# EAGLE design breakout_da14580 (EAGLE 7.2.0)
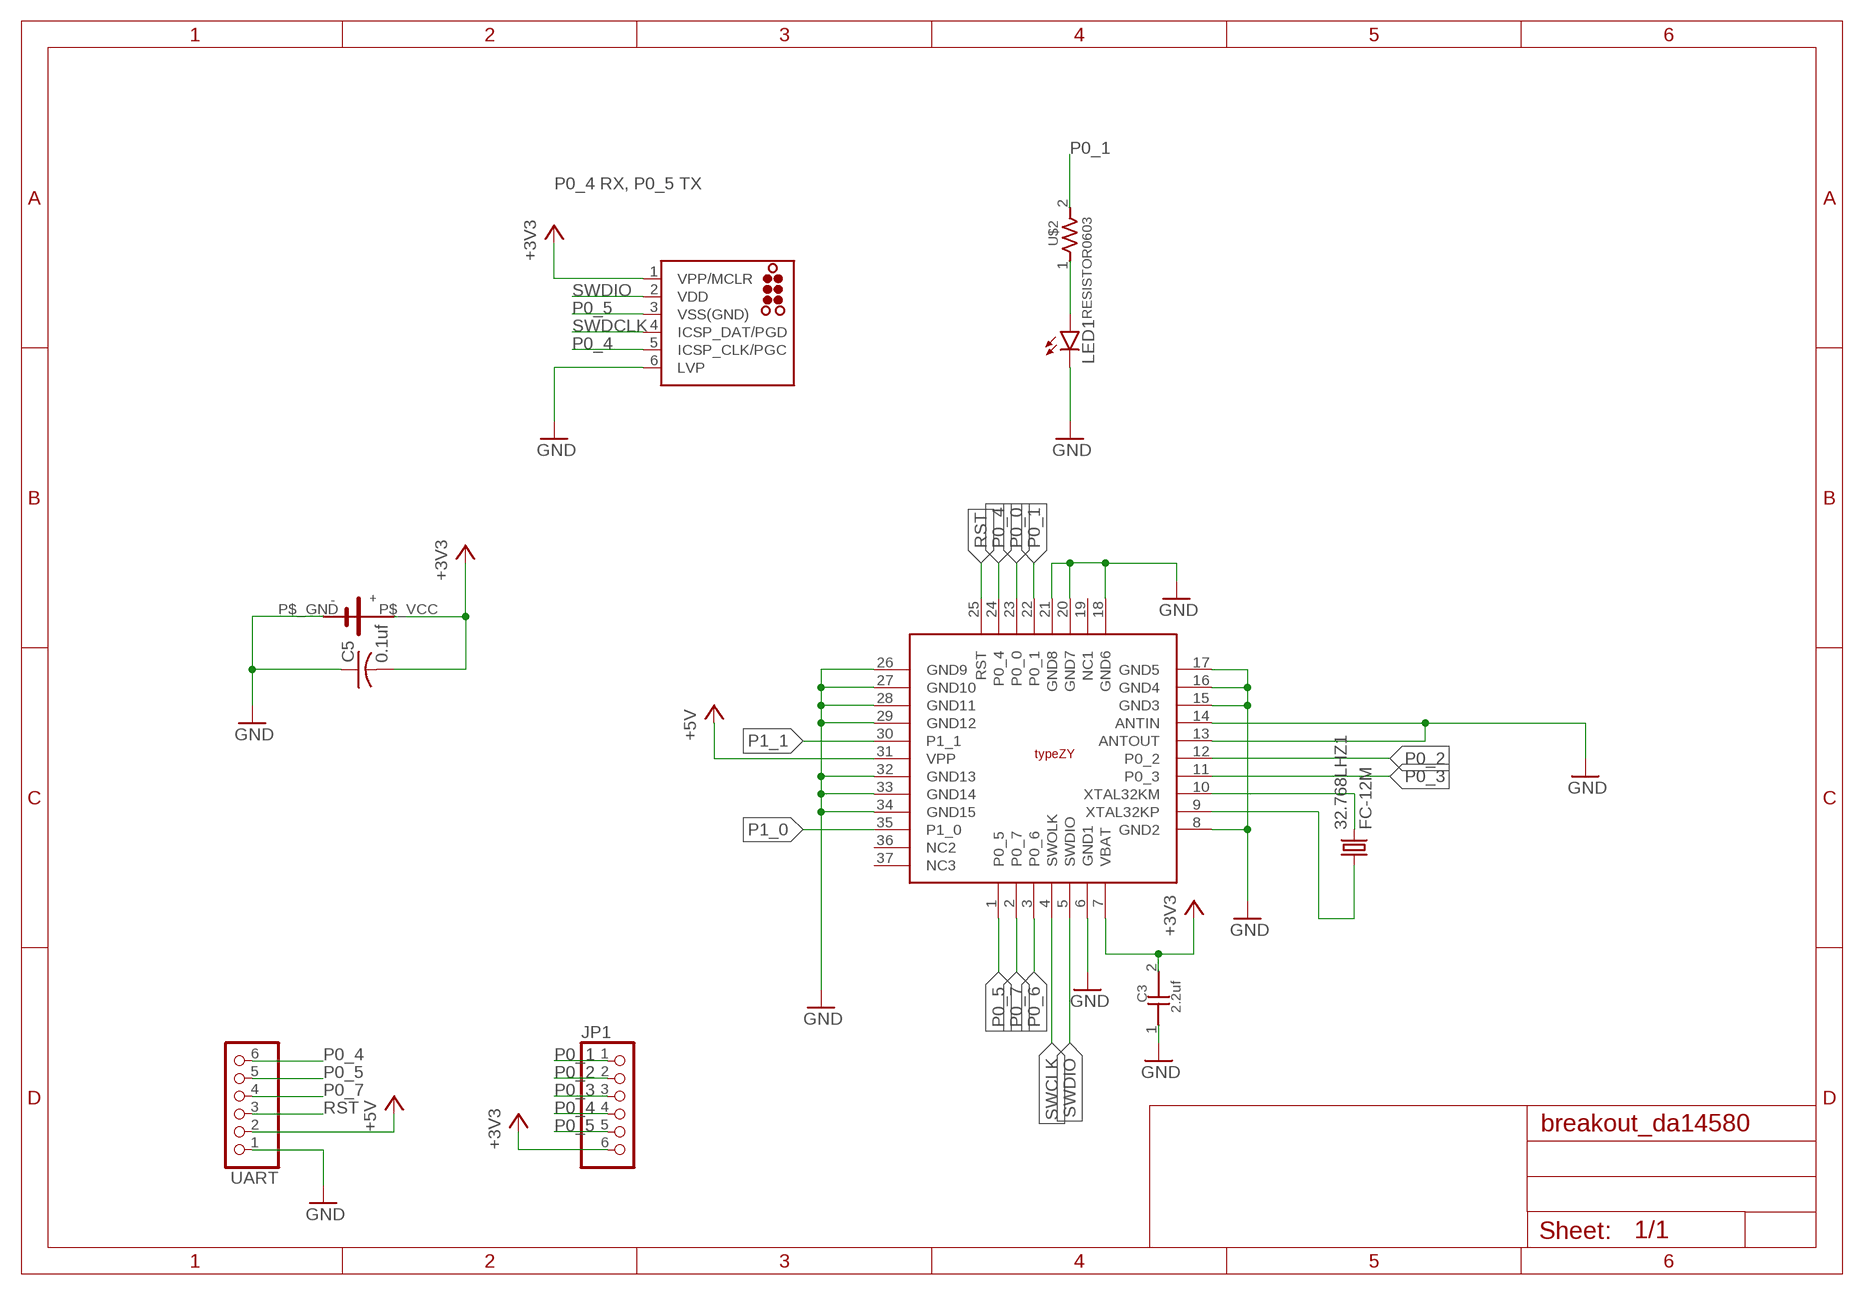
[diagram p0: schematic, sheet 1]

## Parts
32.768LHZ1  FC-12M  [FC-12M]
C3  2.2uf  CAPACITOR0603  [0603]
C5  0.1uf  C-USC0603  [C0603]
J1  TC2030-MCP  [TC2030-MCP]
JP1  PINHD-1X6  [1X06]
LED1  LED-EIA0603  [EIA0603-LED]
U$1  MURATA-TYPEZY  [MURATA_TYPEZY]
U$2  RESISTOR0603  [0603]
U$3  SMTU2450-BOTTOM-MINI  [SMTU2450-BOTTOM-MINI]
UART  PINHD-1X6  [1X06]

## Nets
+3V3: C3.2 C5.2 J1.1(VPP/MCLR) JP1.6 U$1.7(VBAT) U$3.P$_VCC
+5V: U$1.31(VPP) UART.2
GND: C3.1 C5.1 J1.6(LVP) LED1.C U$1.6(GND1) U$1.8(GND2) U$1.13(ANTOUT) U$1.14(ANTIN) U$1.15(GND3) U$1.16(GND4) U$1.17(GND5) U$1.18(GND6) U$1.20(GND7) U$1.21(GND8) U$1.26(GND9) U$1.27(GND10) U$1.28(GND11) U$1.29(GND12) U$1.32(GND13) U$1.33(GND14) U$1.34(GND15) U$3.P$_GND UART.1
N$1: LED1.A U$2.1
P0_0: U$1.23(P0_0)
P0_1: JP1.1 U$1.22(P0_1) U$2.2
P0_2: JP1.2 U$1.12(P0_2)
P0_3: JP1.3 U$1.11(P0_3)
P0_4: J1.5(ICSP_CLK/PGC) JP1.4 U$1.24(P0_4) UART.6
P0_5: J1.3(VSS(GND)) JP1.5 U$1.1(P0_5) UART.5
P0_6: U$1.3(P0_6)
P0_7: U$1.2(P0_7) UART.4
P1_0: U$1.35(P1_0)
P1_1: U$1.30(P1_1)
RST: U$1.25(RST) UART.3
SWCLK: U$1.4(SWOLK)
SWDCLK: J1.4(ICSP_DAT/PGD)
SWDIO: J1.2(VDD) U$1.5(SWDIO)
XTAL32KM: 32.768LHZ1.2 U$1.10(XTAL32KM)
XTAL32KP: 32.768LHZ1.1 U$1.9(XTAL32KP)
Unconnected: U$1.19(NC1) U$1.36(NC2) U$1.37(NC3)

## Notes on the sheet
- P0_4 RX, P0_5 TX

## Library data of the parts
32.768LHZ1 = crystal:FC-12M: kHz RANGE CRYSTAL UNIT LOW PROFILE SMD Source: Epson Toyocom FC-12M.pdf
C3 = GClue-Capacitor:CAPACITOR
C5 = adafruit:C-US: CAPACITOR, American symbol
J1 = tag-connect:TC2030: TAG-CONNECT ICSP Connector Manufacturer: Tag-Connect <http://www.tag-connect.com> Cable for easy In-Circuit Serial Programming. Designed for Microchip ICD2, suitable for many others. Two variants - one "with legs" (for hands-free fit on PCB) and another "without legs" for quick programming. PAD Description 1 MCLR/Vpp 2 Vdd 3 GND 4 PGD (ISPDAT) 5 PGC (ISPCLK) 6 nc (used for LVP) ©2009 ROFA.cz - modified and updated by Robert Darlington ‹rdarlington@gmail.com›
JP1 UART = adafruit:PINHD-1X6: PIN HEADER
LED1 = gclue:LED: LED
U$1 = GClueBT:MURATA-TYPEZY
U$2 = GClue-Resistors:RESISTOR
U$3 = gclue:SMTU2450-BOTTOM-MINI

## Board
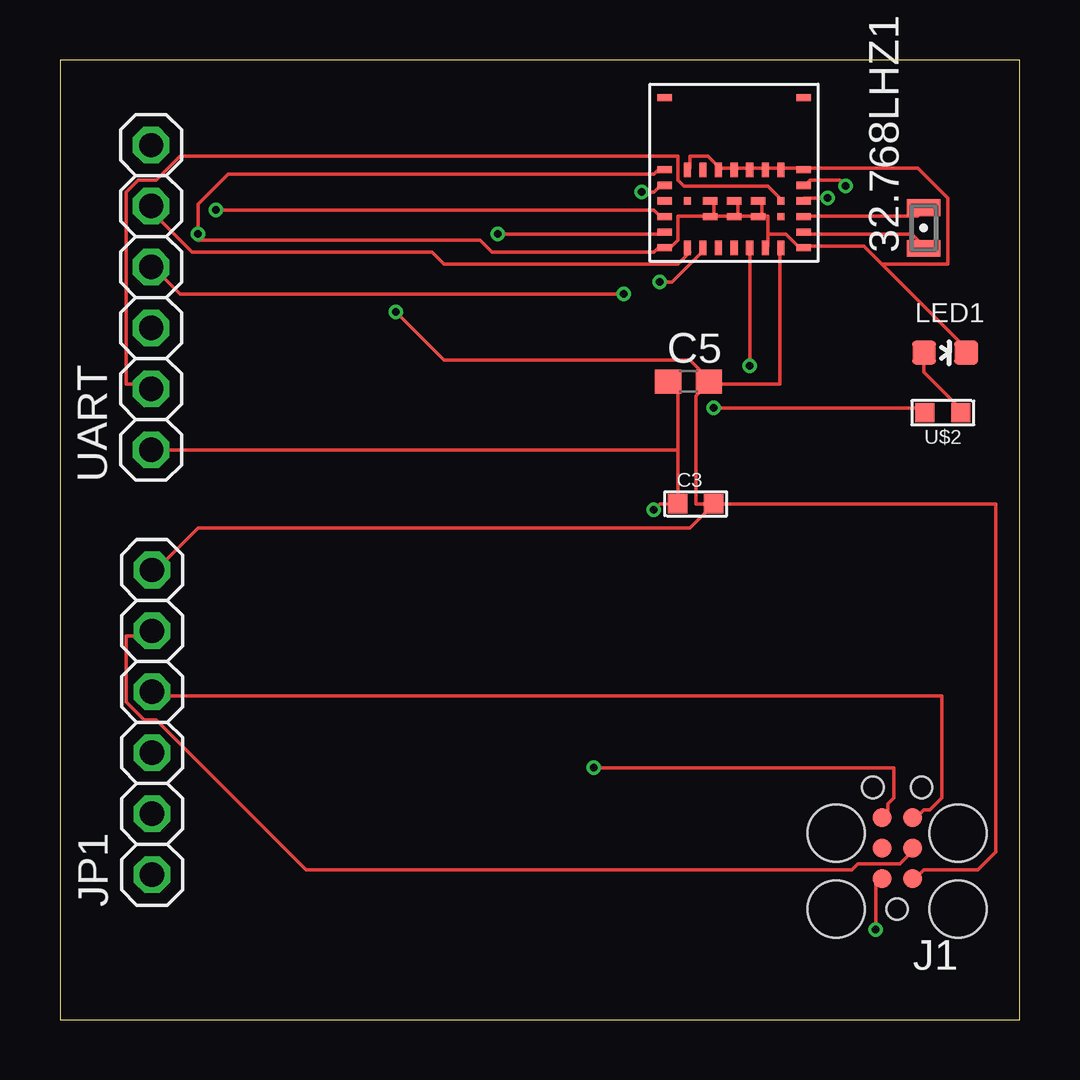
[diagram p1: board, top side]
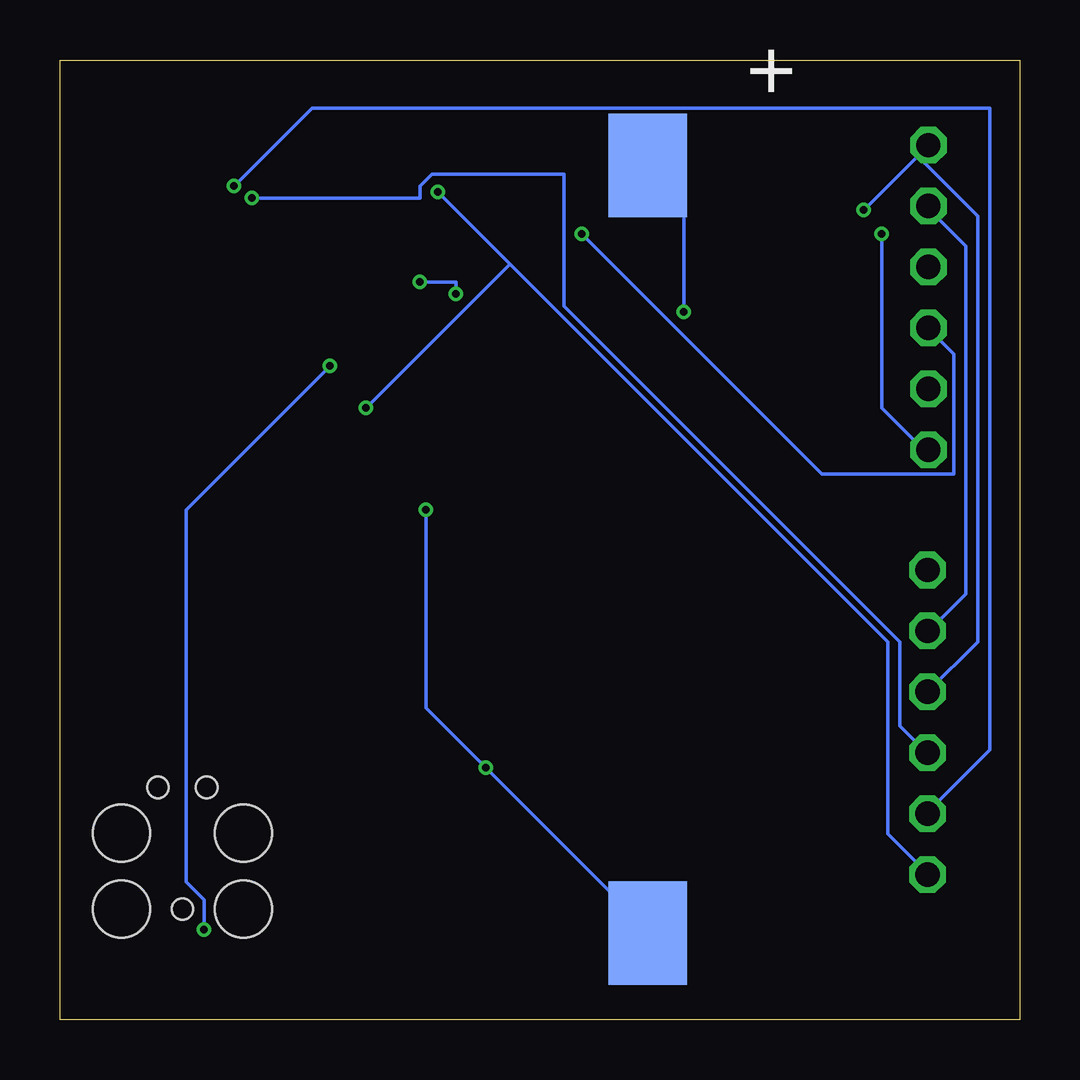
[diagram p2: board, bottom side, seen from below]

Size 40 x 40 mm. Coordinates in mm from the lower left corner, seen from the top.
Outline: 0,0 40,0 40,40 0,40 0,0
Copper layers (1*16): Top 0.035mm / dielectric 1.5mm / Bottom 0.035mm
Design rules "SeeedStudio_2layer_DRU_no_angle_20140221": minimum track width 6mil, minimum drill 12mil, track to track 6mil, track to pad 6mil, pad to pad 6mil, via to via 6mil, smd to smd 0mil, copper to edge 10mil, drill to drill 10mil, minimum pad ring 10mil, minimum via ring 6mil, stop-mask expansion 2mil, vias tented up to drill 100mil, thermal gap 10mil

### Footprints (pad centres in the part's own frame; a part is rotated, then mirrored left to right if it is on the bottom)
FC-12M = smd 0.7 x 1.4: 1 -0.85,0; 2 0.85,0
0603 = smd 0.8 x 0.8: 1 -0.75,0; 2 0.75,0
C0603 = smd 1.1 x 1: 1 -0.85,0; 2 0.85,0
TC2030-MCP = smd 0.787 x 0.787: 1 1.27,-0.635; 2 1.27,0.635; 3 2.54,-0.635; 4 2.54,0.635; 5 3.81,-0.635; 6 3.81,0.635 | hole 0.889: 0,0; 5.08,-1.016; 5.08,1.016 | hole 2.375: 0,2.54; 0,-2.54; 3.175,-2.54; 3.175,2.54
1X06 = drill 1.016 octagon: 1 -6.35,0; 2 -3.81,0; 3 -1.27,0; 4 1.27,0; 5 3.81,0; 6 6.35,0
EIA0603-LED = smd 1 x 1: A 0,-0.877; C 0,0.877
MURATA_TYPEZY = smd 0.3 x 0.6: 1 -1.95,-1.625; 2 -1.3,-1.625; 3 -0.65,-1.625; 4 0,-1.625; 5 0.65,-1.625; 6 1.3,-1.625; 7 1.95,-1.625; 14 1.95,1.625; 15 1.3,1.625; 16 0.65,1.625; 17 0,1.625; 18 -0.65,1.625; 19 -1.3,1.625; 20 -1.95,1.625 | smd 0.6 x 0.3: 8 2.9,-1.625; 9 2.9,-0.975; 10 2.9,-0.325; 11 2.9,0.325; 12 2.9,0.975; 13 2.9,1.625; 21 -2.9,1.625; 22 -2.9,0.975; 23 -2.9,0.325; 24 -2.9,-0.325; 25 -2.9,-0.975; 26 -2.9,-1.625; 27 -1,-0.325; 28 0,-0.325; 29 1,-0.325; 32 1,0.325; 33 0,0.325; 34 -1,0.325; 36 2.9,4.625; 37 -2.9,4.625 | smd 0.3 x 0.3: 30 1.95,-0.325; 31 1.95,0.325; 35 -1.95,0.325
SMTU2450-BOTTOM-MINI = smd 3.251 x 4.318 bottom: P$_GND 0,-16; P$_VCC 0,16

### Placement (x,y rotation side)
32.768LHZ1  36,33 90 top
C3  26.5,21.5 0 top
C5  26.2,26.6 0 top
J1  34.9,4.6 90 top
JP1  3.84,12.39 90 top
LED1  36.9,27.8 270 top
U$1  28.1,33.8 0 top
U$2  36.8,25.3 180 top
U$3  15.5,19.6 0 top
UART  3.8,30.1 90 top

### Tracks (layer width: path | path; a pad name or v marks a point on that pad's centre or on a via)
+3V3  (via drill 0.3)
  Top 0.152: U$1.7 30,32 30,26.5 27.25,26.5 C5.2 | C3.2 39,21.5 39,7 38.25,6.25 36,6.25 35.75,6 J1.1 | C3.2 26.25,20.5 5.75,20.5 4,18.75 JP1.6 | C3.2 26.5,21.5 26.5,26 27,26.5 C5.2 | v14,29.5 16,27.5 26.25,27.5 27,26.75 C5.2
  Bottom 0.152: v14,29.5 14,34 15.5,35.5 U$3.P$_VCC
+5V
  Top 0.152: U$1.31 30,34.25 29.5,34.75 26,34.75 25.75,35 25.75,36 5,36 4,35 3.25,35 2.75,34.5 2.75,26.5 3.75,26.5 UART.2
GND  (via drill 0.3)
  Top 0.152: v22.25,10.5 34.75,10.5 34.75,9.25 34.5,9 34.5,8.5 J1.6 | 25.75,23.75 25.75,26.5 25.5,26.5 C5.1 | 25.75,23.75 C3.1 25,21.5 v24.75,21.25 | UART.1 25.75,23.75 | 30,35.5 29.5,35.5 | 30,35.5 31,35.5 | 30,35.5 U$1.14 | 27.5,35.5 27,36 26.25,36 26.25,35.5 U$1.20 | 27.5,35.5 28,35.5 | 27.5,35.5 U$1.18 | 28,35.5 28.75,35.5 | 28,35.5 U$1.17 | 28.75,35.5 29.5,35.5 | 29.5,35.5 U$1.15 | 28.75,35.5 U$1.16 | 28.25,33.5 28.25,34 U$1.33 | 29.25,33.5 29.25,34 U$1.32 | 29.5,32.75 29.5,33.5 29.25,33.5 | 29.5,32.75 29.5,32.25 U$1.6 | 29.25,33.5 U$1.29 29,33.5 28.25,33.5 | 31,32.25 30.75,32.25 30.25,32.75 29.5,32.75 | 28.25,33.5 U$1.28 28,33.5 27.25,33.5 | 34.25,31.5 33.5,32.25 31,32.25 | 34.25,31.5 37.75,28 LED1.C | 31,32.25 U$1.8 | 31,35.5 35.75,35.5 37,34.25 37,31.5 34.25,31.5 | 31,35.5 U$1.13 | 27.25,33.5 27.25,34 U$1.34 | U$1.21 25,35.5 24.75,35.25 7,35.25 5.75,34 v5.75,32.75 5.75,32.5 17.5,32.5 18,32 24.75,32 25,32.25 U$1.26 25.25,32.25 25.5,32.25 25.75,32.5 25.75,33.5 27,33.5 U$1.27 27.25,33.5
  Bottom 0.152: U$3.P$_GND 15.5,3.75 v22.25,10.5 24.75,13 v24.75,21.25 | v5.75,32.75 5.75,25.5 4,23.75 UART.1
N$1
  Top 0.152: U$2.1 37.5,25.5 36,27 36,27.75 LED1.A
P0_1  (via drill 0.3)
  Top 0.152: v24.25,34.5 24.75,34.5 25,34.75 U$1.22 | v27.25,25.5 36,25.5 U$2.2
  Bottom 0.152: 21.25,31.5 5.5,15.75 5.5,7.75 4,6.25 JP1.1 | 21.25,31.5 v24.25,34.5 | 21.25,31.5 v27.25,25.5
P0_2  (via drill 0.3)
  Top 0.152: v32.75,34.75 32.5,35 31.25,35 31,34.75 U$1.12
  Bottom 0.152: v32.75,34.75 29.5,38 1.25,38 1.25,11.25 3.75,8.75 JP1.2
P0_3  (via drill 0.3)
  Top 0.152: v32,34.25 31,34.25 U$1.11
  Bottom 0.152: v32,34.25 25,34.25 25,34.75 24.5,35.25 19,35.25 19,29.75 5,15.75 5,12.25 4,11.25 JP1.3
P0_4  (via drill 0.3)
  Top 0.152: v6.5,33.75 24.75,33.75 25,33.5 U$1.24 | J1.5 35.75,8.5 36,8.75 36.25,8.75 36.75,9.25 36.75,13.5 4,13.5 JP1.4
  Bottom 0.152: 4.25,36 UART.6 4,36.25 | 4.25,36 v6.5,33.75 | 4.25,36 1.75,33.5 1.75,15.75 JP1.4
P0_5
  Top 0.152: U$1.1 26.25,32 25.75,31.5 16,31.5 15.5,32 5.5,32 3.75,33.75 UART.5 | J1.3 35.5,7 35,6.5 33.25,6.5 33,6.25 10.25,6.25 4,12.5 3.5,12.5 2.75,13.25 2.75,16 3.75,16 JP1.5
  Bottom 0.152: UART.5 3.75,33.75 2.25,32.25 2.25,17.75 3.75,16.25 JP1.5
P0_7  (via drill 0.3)
  Top 0.152: v25,30.75 25.5,30.75 26.75,32 U$1.2 | v23.5,30.25 5,30.25 4,31.25 UART.4
  Bottom 0.152: v25,30.75 23.5,30.75 v23.5,30.25
RST  (via drill 0.3)
  Top 0.152: v18.25,32.75 25,32.75 U$1.25
  Bottom 0.152: v18.25,32.75 8.25,22.75 2.75,22.75 2.75,27.75 3.75,28.75 UART.3
SWDIO  (via drill 0.3)
  Top 0.152: v28.75,27.25 U$1.5 | v34,3.75 34,5.75 34.25,5.75 J1.2
  Bottom 0.152: v28.75,27.25 34.75,21.25 34.75,5.75 34,5 v34,3.75
XTAL32KM
  Top 0.152: U$1.10 31,33.5 35.75,33.5 36,33.75 32.768LHZ1.2
XTAL32KP
  Top 0.152: U$1.9 31,32.75 35.5,32.75 36,32.25 32.768LHZ1.1